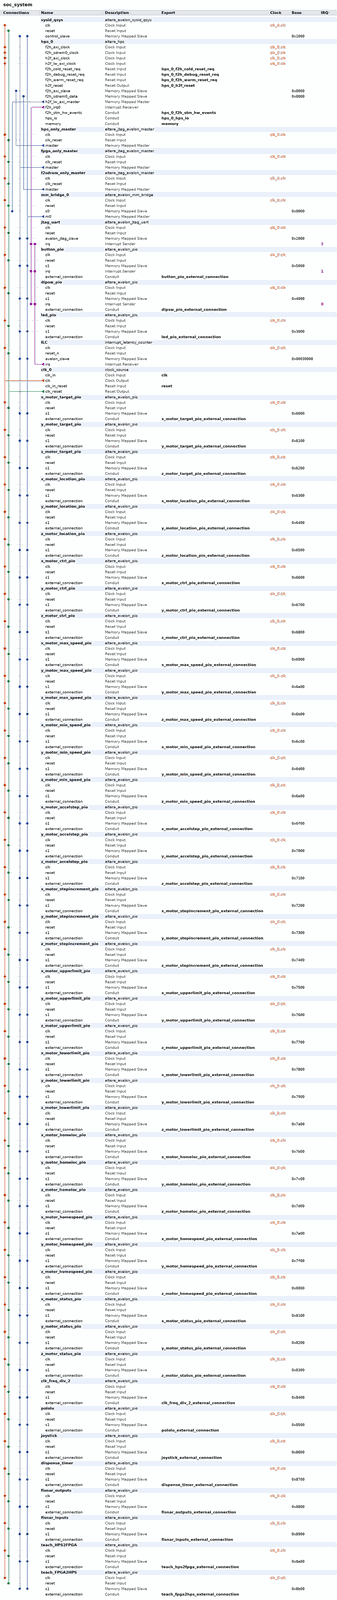
[diagram p0: system contents, whole]
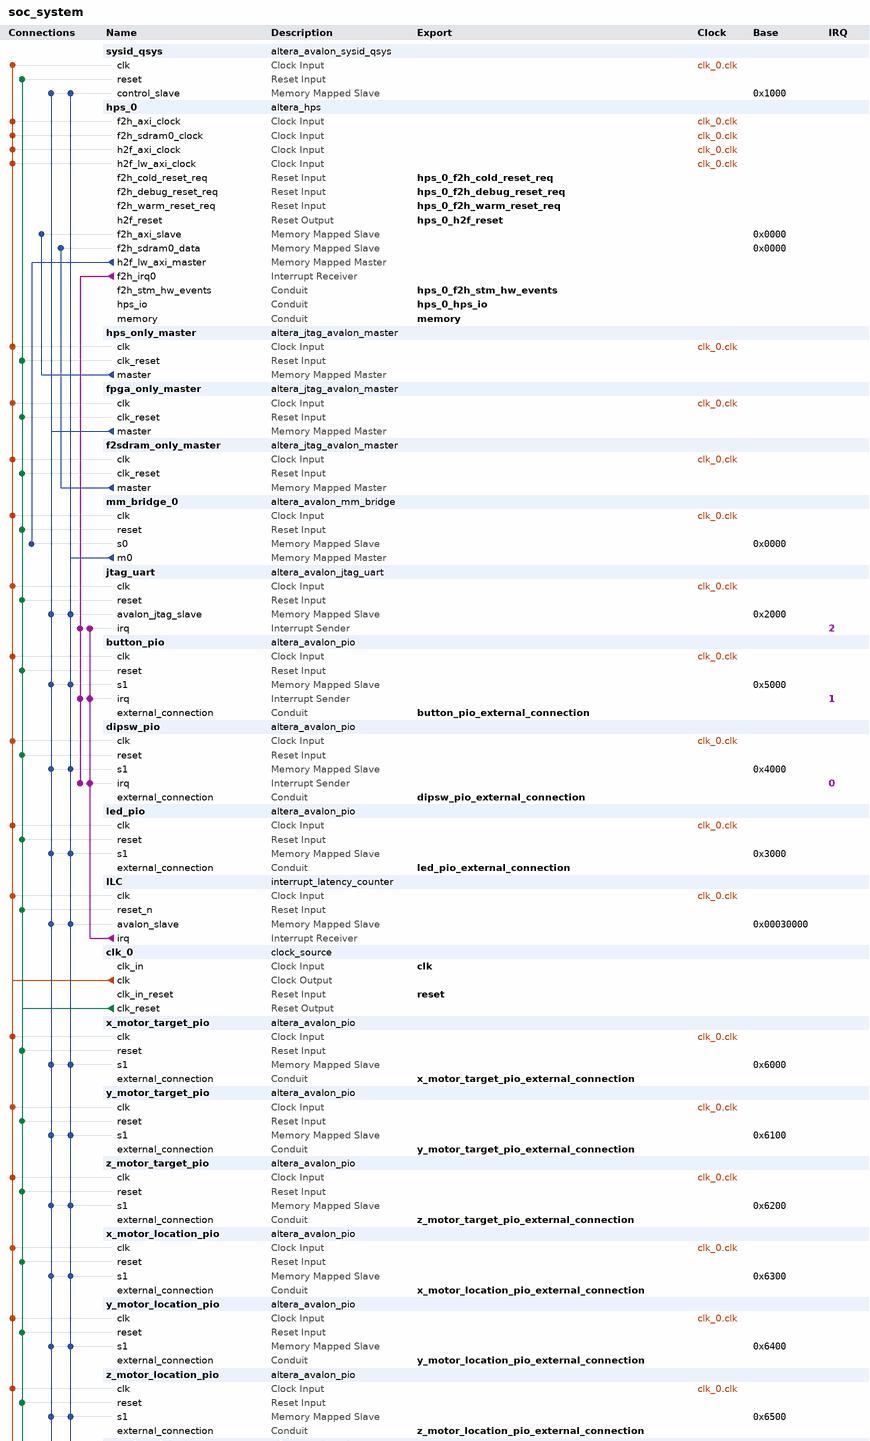
[diagram p1: system contents, upper part]
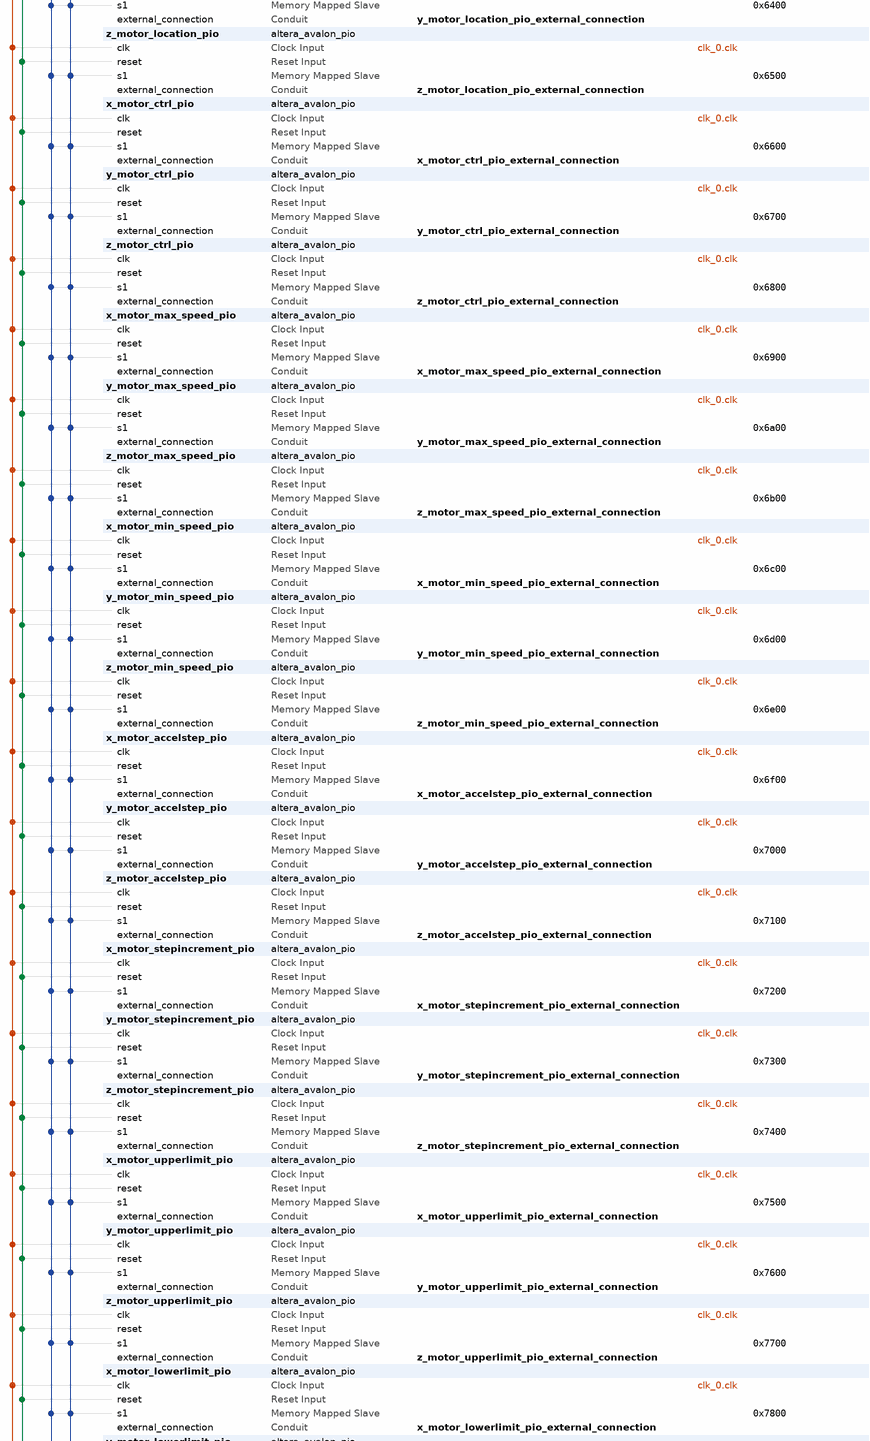
[diagram p2: system contents, middle part]
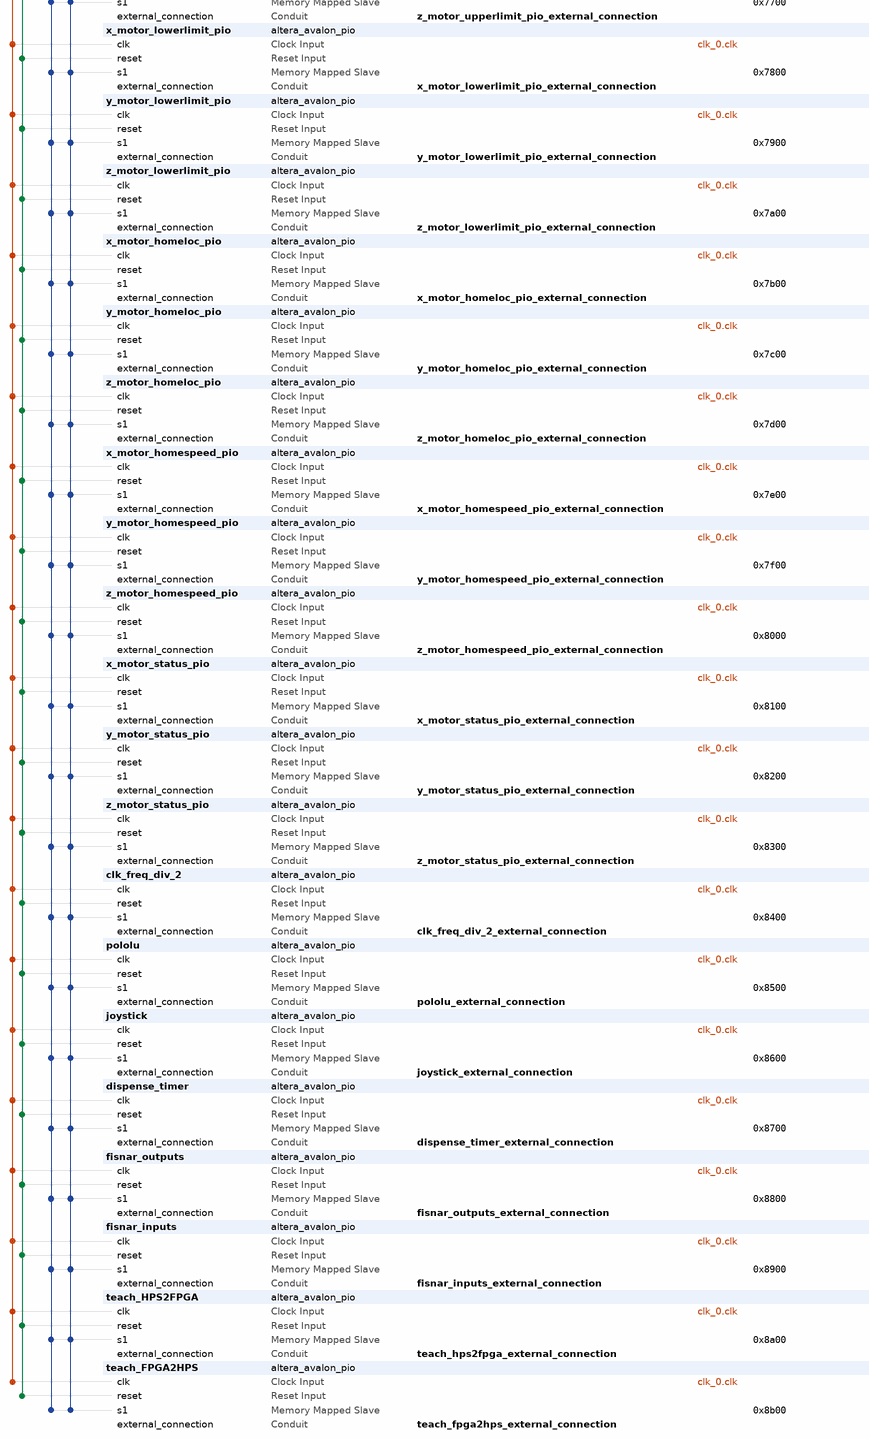
[diagram p3: system contents, lower part]
# Platform Designer (Qsys) system soc_system, Cyclone V 5CSEBA6U23I7
# Parameters at their usual value, and those the tool derives, are not listed.
package require -exact qsys 18.1
create_system soc_system
set_project_property DEVICE_FAMILY {Cyclone V}
set_project_property DEVICE 5CSEBA6U23I7

add_instance sysid_qsys altera_avalon_sysid_qsys 18.1
set_instance_parameter_value sysid_qsys id -1395322110

add_instance hps_0 altera_hps 18.1
set_instance_parameter_value hps_0 EMAC1_Mode RGMII
set_instance_parameter_value hps_0 EMAC1_PinMuxing {HPS I/O Set 0}
set_instance_parameter_value hps_0 F2SCLK_COLDRST_Enable true
set_instance_parameter_value hps_0 F2SCLK_DBGRST_Enable true
set_instance_parameter_value hps_0 F2SCLK_WARMRST_Enable true
set_instance_parameter_value hps_0 F2SDRAM_Type {Avalon-MM Bidirectional}
set_instance_parameter_value hps_0 F2SDRAM_Width 256
set_instance_parameter_value hps_0 F2SINTERRUPT_Enable true
set_instance_parameter_value hps_0 F2S_Width 2
set_instance_parameter_value hps_0 FPGA_PERIPHERAL_OUTPUT_CLOCK_FREQ_EMAC0_GTX_CLK 100
set_instance_parameter_value hps_0 FPGA_PERIPHERAL_OUTPUT_CLOCK_FREQ_EMAC0_MD_CLK 100.0
set_instance_parameter_value hps_0 FPGA_PERIPHERAL_OUTPUT_CLOCK_FREQ_EMAC1_GTX_CLK 100
set_instance_parameter_value hps_0 FPGA_PERIPHERAL_OUTPUT_CLOCK_FREQ_EMAC1_MD_CLK 100.0
set_instance_parameter_value hps_0 HPS_PROTOCOL DDR3
set_instance_parameter_value hps_0 I2C0_Mode I2C
set_instance_parameter_value hps_0 I2C0_PinMuxing {HPS I/O Set 0}
set_instance_parameter_value hps_0 I2C1_Mode I2C
set_instance_parameter_value hps_0 I2C1_PinMuxing {HPS I/O Set 0}
set_instance_parameter_value hps_0 LWH2F_Enable true
set_instance_parameter_value hps_0 MEM_BANKADDR_WIDTH 3
set_instance_parameter_value hps_0 MEM_CLK_FREQ 400.0
set_instance_parameter_value hps_0 MEM_COL_ADDR_WIDTH 10
set_instance_parameter_value hps_0 MEM_DQ_WIDTH 32
set_instance_parameter_value hps_0 MEM_DRV_STR RZQ/6
set_instance_parameter_value hps_0 MEM_ROW_ADDR_WIDTH 15
set_instance_parameter_value hps_0 MEM_RTT_NOM RZQ/6
set_instance_parameter_value hps_0 MEM_RTT_WR {Dynamic ODT off}
set_instance_parameter_value hps_0 MEM_TCL 7
set_instance_parameter_value hps_0 MEM_TFAW_NS 37.5
set_instance_parameter_value hps_0 MEM_TRAS_NS 35.0
set_instance_parameter_value hps_0 MEM_TRCD_NS 13.75
set_instance_parameter_value hps_0 MEM_TRFC_NS 300.0
set_instance_parameter_value hps_0 MEM_TRP_NS 13.75
set_instance_parameter_value hps_0 MEM_VENDOR Other
set_instance_parameter_value hps_0 MEM_WTCL 7
set_instance_parameter_value hps_0 QSPI_Mode N/A
set_instance_parameter_value hps_0 QSPI_PinMuxing Unused
set_instance_parameter_value hps_0 REF_CLK_FREQ 25.0
set_instance_parameter_value hps_0 S2FCLK_USER2CLK 4
set_instance_parameter_value hps_0 S2F_Width 2
set_instance_parameter_value hps_0 SDIO_Mode {4-bit Data}
set_instance_parameter_value hps_0 SDIO_PinMuxing {HPS I/O Set 0}
set_instance_parameter_value hps_0 SPIM1_Mode {Single Slave Select}
set_instance_parameter_value hps_0 SPIM1_PinMuxing {HPS I/O Set 0}
set_instance_parameter_value hps_0 STM_Enable true
set_instance_parameter_value hps_0 TIMING_BOARD_AC_SKEW 0.02
set_instance_parameter_value hps_0 TIMING_BOARD_AC_TO_CK_SKEW 0.0
set_instance_parameter_value hps_0 TIMING_BOARD_DQ_TO_DQS_SKEW 0.0
set_instance_parameter_value hps_0 TIMING_BOARD_MAX_CK_DELAY 0.6
set_instance_parameter_value hps_0 TIMING_BOARD_MAX_DQS_DELAY 0.6
set_instance_parameter_value hps_0 TIMING_BOARD_SKEW_BETWEEN_DQS 0.02
set_instance_parameter_value hps_0 TIMING_BOARD_SKEW_CKDQS_DIMM_MAX 0.01
set_instance_parameter_value hps_0 TIMING_BOARD_SKEW_CKDQS_DIMM_MIN -0.01
set_instance_parameter_value hps_0 TIMING_BOARD_SKEW_WITHIN_DQS 0.02
set_instance_parameter_value hps_0 TIMING_TDH 125
set_instance_parameter_value hps_0 TIMING_TDQSCK 400
set_instance_parameter_value hps_0 TIMING_TDQSQ 120
set_instance_parameter_value hps_0 TIMING_TDS 50
set_instance_parameter_value hps_0 TIMING_TIH 250
set_instance_parameter_value hps_0 TIMING_TIS 175
set_instance_parameter_value hps_0 TIMING_TQSH 0.38
set_instance_parameter_value hps_0 UART0_Mode {No Flow Control}
set_instance_parameter_value hps_0 UART0_PinMuxing {HPS I/O Set 0}
set_instance_parameter_value hps_0 USB1_Mode SDR
set_instance_parameter_value hps_0 USB1_PinMuxing {HPS I/O Set 0}
set_instance_parameter_value hps_0 desired_cfg_clk_mhz 100.0
set_instance_parameter_value hps_0 desired_qspi_clk_mhz 370.0

add_instance hps_only_master altera_jtag_avalon_master 18.1

add_instance fpga_only_master altera_jtag_avalon_master 18.1

add_instance f2sdram_only_master altera_jtag_avalon_master 18.1

add_instance mm_bridge_0 altera_avalon_mm_bridge 18.1
set_instance_parameter_value mm_bridge_0 ADDRESS_UNITS SYMBOLS
set_instance_parameter_value mm_bridge_0 ADDRESS_WIDTH 10
set_instance_parameter_value mm_bridge_0 DATA_WIDTH 32
set_instance_parameter_value mm_bridge_0 MAX_PENDING_RESPONSES 4
set_instance_parameter_value mm_bridge_0 USE_AUTO_ADDRESS_WIDTH 1

add_instance jtag_uart altera_avalon_jtag_uart 18.1
set_instance_parameter_value jtag_uart allowMultipleConnections true
set_instance_parameter_value jtag_uart simInteractiveOptions INTERACTIVE_ASCII_OUTPUT

add_instance button_pio altera_avalon_pio 18.1
set_instance_parameter_value button_pio bitClearingEdgeCapReg true
set_instance_parameter_value button_pio captureEdge true
set_instance_parameter_value button_pio direction Input
set_instance_parameter_value button_pio edgeType FALLING
set_instance_parameter_value button_pio generateIRQ true
set_instance_parameter_value button_pio irqType EDGE
set_instance_parameter_value button_pio width 2

add_instance dipsw_pio altera_avalon_pio 18.1
set_instance_parameter_value dipsw_pio bitClearingEdgeCapReg true
set_instance_parameter_value dipsw_pio captureEdge true
set_instance_parameter_value dipsw_pio direction Input
set_instance_parameter_value dipsw_pio edgeType ANY
set_instance_parameter_value dipsw_pio generateIRQ true
set_instance_parameter_value dipsw_pio irqType EDGE
set_instance_parameter_value dipsw_pio width 4

add_instance led_pio altera_avalon_pio 18.1
set_instance_parameter_value led_pio direction Output
set_instance_parameter_value led_pio resetValue 255
set_instance_parameter_value led_pio width 8

add_instance ILC interrupt_latency_counter 18.1

add_instance clk_0 clock_source 18.1
set_instance_parameter_value clk_0 clockFrequency 50000000

add_instance x_motor_target_pio altera_avalon_pio 18.1
set_instance_parameter_value x_motor_target_pio direction Output
set_instance_parameter_value x_motor_target_pio width 32

add_instance y_motor_target_pio altera_avalon_pio 18.1
set_instance_parameter_value y_motor_target_pio direction Output
set_instance_parameter_value y_motor_target_pio width 32

add_instance z_motor_target_pio altera_avalon_pio 18.1
set_instance_parameter_value z_motor_target_pio direction Output
set_instance_parameter_value z_motor_target_pio width 32

add_instance x_motor_location_pio altera_avalon_pio 18.1
set_instance_parameter_value x_motor_location_pio direction Input
set_instance_parameter_value x_motor_location_pio width 32

add_instance y_motor_location_pio altera_avalon_pio 18.1
set_instance_parameter_value y_motor_location_pio direction Input
set_instance_parameter_value y_motor_location_pio width 32

add_instance z_motor_location_pio altera_avalon_pio 18.1
set_instance_parameter_value z_motor_location_pio direction Input
set_instance_parameter_value z_motor_location_pio width 32

add_instance x_motor_ctrl_pio altera_avalon_pio 18.1
set_instance_parameter_value x_motor_ctrl_pio direction Output
set_instance_parameter_value x_motor_ctrl_pio width 32

add_instance y_motor_ctrl_pio altera_avalon_pio 18.1
set_instance_parameter_value y_motor_ctrl_pio direction Output
set_instance_parameter_value y_motor_ctrl_pio width 32

add_instance z_motor_ctrl_pio altera_avalon_pio 18.1
set_instance_parameter_value z_motor_ctrl_pio direction Output
set_instance_parameter_value z_motor_ctrl_pio width 32

add_instance x_motor_max_speed_pio altera_avalon_pio 18.1
set_instance_parameter_value x_motor_max_speed_pio direction Output
set_instance_parameter_value x_motor_max_speed_pio width 32

add_instance y_motor_max_speed_pio altera_avalon_pio 18.1
set_instance_parameter_value y_motor_max_speed_pio direction Output
set_instance_parameter_value y_motor_max_speed_pio width 32

add_instance z_motor_max_speed_pio altera_avalon_pio 18.1
set_instance_parameter_value z_motor_max_speed_pio direction Output
set_instance_parameter_value z_motor_max_speed_pio width 32

add_instance x_motor_min_speed_pio altera_avalon_pio 18.1
set_instance_parameter_value x_motor_min_speed_pio direction Output
set_instance_parameter_value x_motor_min_speed_pio width 32

add_instance y_motor_min_speed_pio altera_avalon_pio 18.1
set_instance_parameter_value y_motor_min_speed_pio direction Output
set_instance_parameter_value y_motor_min_speed_pio width 32

add_instance z_motor_min_speed_pio altera_avalon_pio 18.1
set_instance_parameter_value z_motor_min_speed_pio direction Output
set_instance_parameter_value z_motor_min_speed_pio width 32

add_instance x_motor_accelstep_pio altera_avalon_pio 18.1
set_instance_parameter_value x_motor_accelstep_pio direction Output
set_instance_parameter_value x_motor_accelstep_pio width 32

add_instance y_motor_accelstep_pio altera_avalon_pio 18.1
set_instance_parameter_value y_motor_accelstep_pio direction Output
set_instance_parameter_value y_motor_accelstep_pio width 32

add_instance z_motor_accelstep_pio altera_avalon_pio 18.1
set_instance_parameter_value z_motor_accelstep_pio direction Output
set_instance_parameter_value z_motor_accelstep_pio width 32

add_instance x_motor_stepincrement_pio altera_avalon_pio 18.1
set_instance_parameter_value x_motor_stepincrement_pio direction Output
set_instance_parameter_value x_motor_stepincrement_pio width 32

add_instance y_motor_stepincrement_pio altera_avalon_pio 18.1
set_instance_parameter_value y_motor_stepincrement_pio direction Output
set_instance_parameter_value y_motor_stepincrement_pio width 32

add_instance z_motor_stepincrement_pio altera_avalon_pio 18.1
set_instance_parameter_value z_motor_stepincrement_pio direction Output
set_instance_parameter_value z_motor_stepincrement_pio width 32

add_instance x_motor_upperlimit_pio altera_avalon_pio 18.1
set_instance_parameter_value x_motor_upperlimit_pio direction Output
set_instance_parameter_value x_motor_upperlimit_pio width 32

add_instance y_motor_upperlimit_pio altera_avalon_pio 18.1
set_instance_parameter_value y_motor_upperlimit_pio direction Output
set_instance_parameter_value y_motor_upperlimit_pio width 32

add_instance z_motor_upperlimit_pio altera_avalon_pio 18.1
set_instance_parameter_value z_motor_upperlimit_pio direction Output
set_instance_parameter_value z_motor_upperlimit_pio width 32

add_instance x_motor_lowerlimit_pio altera_avalon_pio 18.1
set_instance_parameter_value x_motor_lowerlimit_pio direction Output
set_instance_parameter_value x_motor_lowerlimit_pio width 32

add_instance y_motor_lowerlimit_pio altera_avalon_pio 18.1
set_instance_parameter_value y_motor_lowerlimit_pio direction Output
set_instance_parameter_value y_motor_lowerlimit_pio width 32

add_instance z_motor_lowerlimit_pio altera_avalon_pio 18.1
set_instance_parameter_value z_motor_lowerlimit_pio direction Output
set_instance_parameter_value z_motor_lowerlimit_pio width 32

add_instance x_motor_homeloc_pio altera_avalon_pio 18.1
set_instance_parameter_value x_motor_homeloc_pio direction Output
set_instance_parameter_value x_motor_homeloc_pio width 32

add_instance y_motor_homeloc_pio altera_avalon_pio 18.1
set_instance_parameter_value y_motor_homeloc_pio direction Output
set_instance_parameter_value y_motor_homeloc_pio width 32

add_instance z_motor_homeloc_pio altera_avalon_pio 18.1
set_instance_parameter_value z_motor_homeloc_pio direction Output
set_instance_parameter_value z_motor_homeloc_pio width 32

add_instance x_motor_homespeed_pio altera_avalon_pio 18.1
set_instance_parameter_value x_motor_homespeed_pio direction Output
set_instance_parameter_value x_motor_homespeed_pio width 32

add_instance y_motor_homespeed_pio altera_avalon_pio 18.1
set_instance_parameter_value y_motor_homespeed_pio direction Output
set_instance_parameter_value y_motor_homespeed_pio width 32

add_instance z_motor_homespeed_pio altera_avalon_pio 18.1
set_instance_parameter_value z_motor_homespeed_pio direction Output
set_instance_parameter_value z_motor_homespeed_pio width 32

add_instance x_motor_status_pio altera_avalon_pio 18.1
set_instance_parameter_value x_motor_status_pio direction Input
set_instance_parameter_value x_motor_status_pio width 32

add_instance y_motor_status_pio altera_avalon_pio 18.1
set_instance_parameter_value y_motor_status_pio direction Input
set_instance_parameter_value y_motor_status_pio width 32

add_instance z_motor_status_pio altera_avalon_pio 18.1
set_instance_parameter_value z_motor_status_pio direction Input
set_instance_parameter_value z_motor_status_pio width 32

add_instance clk_freq_div_2 altera_avalon_pio 18.1
set_instance_parameter_value clk_freq_div_2 direction Output
set_instance_parameter_value clk_freq_div_2 width 32

add_instance pololu altera_avalon_pio 18.1
set_instance_parameter_value pololu direction Output
set_instance_parameter_value pololu width 32

add_instance joystick altera_avalon_pio 18.1
set_instance_parameter_value joystick direction Input
set_instance_parameter_value joystick width 32

add_instance dispense_timer altera_avalon_pio 18.1
set_instance_parameter_value dispense_timer direction Output
set_instance_parameter_value dispense_timer width 32

add_instance fisnar_outputs altera_avalon_pio 18.1
set_instance_parameter_value fisnar_outputs direction Output
set_instance_parameter_value fisnar_outputs width 32

add_instance fisnar_inputs altera_avalon_pio 18.1
set_instance_parameter_value fisnar_inputs direction Input
set_instance_parameter_value fisnar_inputs width 32

add_instance teach_HPS2FPGA altera_avalon_pio 18.1
set_instance_parameter_value teach_HPS2FPGA direction Output
set_instance_parameter_value teach_HPS2FPGA width 32

add_instance teach_FPGA2HPS altera_avalon_pio 18.1
set_instance_parameter_value teach_FPGA2HPS direction Input
set_instance_parameter_value teach_FPGA2HPS width 32

# connections
add_connection clk_0.clk button_pio.clk clock
add_connection clk_0.clk clk_freq_div_2.clk clock
add_connection clk_0.clk dipsw_pio.clk clock
add_connection clk_0.clk dispense_timer.clk clock
add_connection clk_0.clk f2sdram_only_master.clk clock
add_connection clk_0.clk fisnar_inputs.clk clock
add_connection clk_0.clk fisnar_outputs.clk clock
add_connection clk_0.clk fpga_only_master.clk clock
add_connection clk_0.clk hps_0.f2h_axi_clock clock
add_connection clk_0.clk hps_0.f2h_sdram0_clock clock
add_connection clk_0.clk hps_0.h2f_axi_clock clock
add_connection clk_0.clk hps_0.h2f_lw_axi_clock clock
add_connection clk_0.clk hps_only_master.clk clock
add_connection clk_0.clk ILC.clk clock
add_connection clk_0.clk joystick.clk clock
add_connection clk_0.clk jtag_uart.clk clock
add_connection clk_0.clk led_pio.clk clock
add_connection clk_0.clk mm_bridge_0.clk clock
add_connection clk_0.clk pololu.clk clock
add_connection clk_0.clk sysid_qsys.clk clock
add_connection clk_0.clk teach_FPGA2HPS.clk clock
add_connection clk_0.clk teach_HPS2FPGA.clk clock
add_connection clk_0.clk x_motor_accelstep_pio.clk clock
add_connection clk_0.clk x_motor_ctrl_pio.clk clock
add_connection clk_0.clk x_motor_homeloc_pio.clk clock
add_connection clk_0.clk x_motor_homespeed_pio.clk clock
add_connection clk_0.clk x_motor_location_pio.clk clock
add_connection clk_0.clk x_motor_lowerlimit_pio.clk clock
add_connection clk_0.clk x_motor_max_speed_pio.clk clock
add_connection clk_0.clk x_motor_min_speed_pio.clk clock
add_connection clk_0.clk x_motor_status_pio.clk clock
add_connection clk_0.clk x_motor_stepincrement_pio.clk clock
add_connection clk_0.clk x_motor_target_pio.clk clock
add_connection clk_0.clk x_motor_upperlimit_pio.clk clock
add_connection clk_0.clk y_motor_accelstep_pio.clk clock
add_connection clk_0.clk y_motor_ctrl_pio.clk clock
add_connection clk_0.clk y_motor_homeloc_pio.clk clock
add_connection clk_0.clk y_motor_homespeed_pio.clk clock
add_connection clk_0.clk y_motor_location_pio.clk clock
add_connection clk_0.clk y_motor_lowerlimit_pio.clk clock
add_connection clk_0.clk y_motor_max_speed_pio.clk clock
add_connection clk_0.clk y_motor_min_speed_pio.clk clock
add_connection clk_0.clk y_motor_status_pio.clk clock
add_connection clk_0.clk y_motor_stepincrement_pio.clk clock
add_connection clk_0.clk y_motor_target_pio.clk clock
add_connection clk_0.clk y_motor_upperlimit_pio.clk clock
add_connection clk_0.clk z_motor_accelstep_pio.clk clock
add_connection clk_0.clk z_motor_ctrl_pio.clk clock
add_connection clk_0.clk z_motor_homeloc_pio.clk clock
add_connection clk_0.clk z_motor_homespeed_pio.clk clock
add_connection clk_0.clk z_motor_location_pio.clk clock
add_connection clk_0.clk z_motor_lowerlimit_pio.clk clock
add_connection clk_0.clk z_motor_max_speed_pio.clk clock
add_connection clk_0.clk z_motor_min_speed_pio.clk clock
add_connection clk_0.clk z_motor_status_pio.clk clock
add_connection clk_0.clk z_motor_stepincrement_pio.clk clock
add_connection clk_0.clk z_motor_target_pio.clk clock
add_connection clk_0.clk z_motor_upperlimit_pio.clk clock
add_connection clk_0.clk_reset button_pio.reset reset
add_connection clk_0.clk_reset clk_freq_div_2.reset reset
add_connection clk_0.clk_reset dipsw_pio.reset reset
add_connection clk_0.clk_reset dispense_timer.reset reset
add_connection clk_0.clk_reset f2sdram_only_master.clk_reset reset
add_connection clk_0.clk_reset fisnar_inputs.reset reset
add_connection clk_0.clk_reset fisnar_outputs.reset reset
add_connection clk_0.clk_reset fpga_only_master.clk_reset reset
add_connection clk_0.clk_reset hps_only_master.clk_reset reset
add_connection clk_0.clk_reset ILC.reset_n reset
add_connection clk_0.clk_reset joystick.reset reset
add_connection clk_0.clk_reset jtag_uart.reset reset
add_connection clk_0.clk_reset led_pio.reset reset
add_connection clk_0.clk_reset mm_bridge_0.reset reset
add_connection clk_0.clk_reset pololu.reset reset
add_connection clk_0.clk_reset sysid_qsys.reset reset
add_connection clk_0.clk_reset teach_FPGA2HPS.reset reset
add_connection clk_0.clk_reset teach_HPS2FPGA.reset reset
add_connection clk_0.clk_reset x_motor_accelstep_pio.reset reset
add_connection clk_0.clk_reset x_motor_ctrl_pio.reset reset
add_connection clk_0.clk_reset x_motor_homeloc_pio.reset reset
add_connection clk_0.clk_reset x_motor_homespeed_pio.reset reset
add_connection clk_0.clk_reset x_motor_location_pio.reset reset
add_connection clk_0.clk_reset x_motor_lowerlimit_pio.reset reset
add_connection clk_0.clk_reset x_motor_max_speed_pio.reset reset
add_connection clk_0.clk_reset x_motor_min_speed_pio.reset reset
add_connection clk_0.clk_reset x_motor_status_pio.reset reset
add_connection clk_0.clk_reset x_motor_stepincrement_pio.reset reset
add_connection clk_0.clk_reset x_motor_target_pio.reset reset
add_connection clk_0.clk_reset x_motor_upperlimit_pio.reset reset
add_connection clk_0.clk_reset y_motor_accelstep_pio.reset reset
add_connection clk_0.clk_reset y_motor_ctrl_pio.reset reset
add_connection clk_0.clk_reset y_motor_homeloc_pio.reset reset
add_connection clk_0.clk_reset y_motor_homespeed_pio.reset reset
add_connection clk_0.clk_reset y_motor_location_pio.reset reset
add_connection clk_0.clk_reset y_motor_lowerlimit_pio.reset reset
add_connection clk_0.clk_reset y_motor_max_speed_pio.reset reset
add_connection clk_0.clk_reset y_motor_min_speed_pio.reset reset
add_connection clk_0.clk_reset y_motor_status_pio.reset reset
add_connection clk_0.clk_reset y_motor_stepincrement_pio.reset reset
add_connection clk_0.clk_reset y_motor_target_pio.reset reset
add_connection clk_0.clk_reset y_motor_upperlimit_pio.reset reset
add_connection clk_0.clk_reset z_motor_accelstep_pio.reset reset
add_connection clk_0.clk_reset z_motor_ctrl_pio.reset reset
add_connection clk_0.clk_reset z_motor_homeloc_pio.reset reset
add_connection clk_0.clk_reset z_motor_homespeed_pio.reset reset
add_connection clk_0.clk_reset z_motor_location_pio.reset reset
add_connection clk_0.clk_reset z_motor_lowerlimit_pio.reset reset
add_connection clk_0.clk_reset z_motor_max_speed_pio.reset reset
add_connection clk_0.clk_reset z_motor_min_speed_pio.reset reset
add_connection clk_0.clk_reset z_motor_status_pio.reset reset
add_connection clk_0.clk_reset z_motor_stepincrement_pio.reset reset
add_connection clk_0.clk_reset z_motor_target_pio.reset reset
add_connection clk_0.clk_reset z_motor_upperlimit_pio.reset reset
add_connection f2sdram_only_master.master hps_0.f2h_sdram0_data avalon
set_connection_parameter_value f2sdram_only_master.master/hps_0.f2h_sdram0_data baseAddress 0x0000
add_connection fpga_only_master.master button_pio.s1 avalon
set_connection_parameter_value fpga_only_master.master/button_pio.s1 baseAddress 0x5000
add_connection fpga_only_master.master clk_freq_div_2.s1 avalon
set_connection_parameter_value fpga_only_master.master/clk_freq_div_2.s1 baseAddress 0x8400
add_connection fpga_only_master.master dipsw_pio.s1 avalon
set_connection_parameter_value fpga_only_master.master/dipsw_pio.s1 baseAddress 0x4000
add_connection fpga_only_master.master dispense_timer.s1 avalon
set_connection_parameter_value fpga_only_master.master/dispense_timer.s1 baseAddress 0x8700
add_connection fpga_only_master.master fisnar_inputs.s1 avalon
set_connection_parameter_value fpga_only_master.master/fisnar_inputs.s1 baseAddress 0x8900
add_connection fpga_only_master.master fisnar_outputs.s1 avalon
set_connection_parameter_value fpga_only_master.master/fisnar_outputs.s1 baseAddress 0x8800
add_connection fpga_only_master.master ILC.avalon_slave avalon
set_connection_parameter_value fpga_only_master.master/ILC.avalon_slave baseAddress 0x00030000
add_connection fpga_only_master.master joystick.s1 avalon
set_connection_parameter_value fpga_only_master.master/joystick.s1 baseAddress 0x8600
add_connection fpga_only_master.master jtag_uart.avalon_jtag_slave avalon
set_connection_parameter_value fpga_only_master.master/jtag_uart.avalon_jtag_slave baseAddress 0x2000
add_connection fpga_only_master.master led_pio.s1 avalon
set_connection_parameter_value fpga_only_master.master/led_pio.s1 baseAddress 0x3000
add_connection fpga_only_master.master pololu.s1 avalon
set_connection_parameter_value fpga_only_master.master/pololu.s1 baseAddress 0x8500
add_connection fpga_only_master.master sysid_qsys.control_slave avalon
set_connection_parameter_value fpga_only_master.master/sysid_qsys.control_slave baseAddress 0x1000
add_connection fpga_only_master.master teach_FPGA2HPS.s1 avalon
set_connection_parameter_value fpga_only_master.master/teach_FPGA2HPS.s1 baseAddress 0x8b00
add_connection fpga_only_master.master teach_HPS2FPGA.s1 avalon
set_connection_parameter_value fpga_only_master.master/teach_HPS2FPGA.s1 baseAddress 0x8a00
add_connection fpga_only_master.master x_motor_accelstep_pio.s1 avalon
set_connection_parameter_value fpga_only_master.master/x_motor_accelstep_pio.s1 baseAddress 0x6f00
add_connection fpga_only_master.master x_motor_ctrl_pio.s1 avalon
set_connection_parameter_value fpga_only_master.master/x_motor_ctrl_pio.s1 baseAddress 0x6600
add_connection fpga_only_master.master x_motor_homeloc_pio.s1 avalon
set_connection_parameter_value fpga_only_master.master/x_motor_homeloc_pio.s1 baseAddress 0x7b00
add_connection fpga_only_master.master x_motor_homespeed_pio.s1 avalon
set_connection_parameter_value fpga_only_master.master/x_motor_homespeed_pio.s1 baseAddress 0x7e00
add_connection fpga_only_master.master x_motor_location_pio.s1 avalon
set_connection_parameter_value fpga_only_master.master/x_motor_location_pio.s1 baseAddress 0x6300
add_connection fpga_only_master.master x_motor_lowerlimit_pio.s1 avalon
set_connection_parameter_value fpga_only_master.master/x_motor_lowerlimit_pio.s1 baseAddress 0x7800
add_connection fpga_only_master.master x_motor_max_speed_pio.s1 avalon
set_connection_parameter_value fpga_only_master.master/x_motor_max_speed_pio.s1 baseAddress 0x6900
add_connection fpga_only_master.master x_motor_min_speed_pio.s1 avalon
set_connection_parameter_value fpga_only_master.master/x_motor_min_speed_pio.s1 baseAddress 0x6c00
add_connection fpga_only_master.master x_motor_status_pio.s1 avalon
set_connection_parameter_value fpga_only_master.master/x_motor_status_pio.s1 baseAddress 0x8100
add_connection fpga_only_master.master x_motor_stepincrement_pio.s1 avalon
set_connection_parameter_value fpga_only_master.master/x_motor_stepincrement_pio.s1 baseAddress 0x7200
add_connection fpga_only_master.master x_motor_target_pio.s1 avalon
set_connection_parameter_value fpga_only_master.master/x_motor_target_pio.s1 baseAddress 0x6000
add_connection fpga_only_master.master x_motor_upperlimit_pio.s1 avalon
set_connection_parameter_value fpga_only_master.master/x_motor_upperlimit_pio.s1 baseAddress 0x7500
add_connection fpga_only_master.master y_motor_accelstep_pio.s1 avalon
set_connection_parameter_value fpga_only_master.master/y_motor_accelstep_pio.s1 baseAddress 0x7000
add_connection fpga_only_master.master y_motor_ctrl_pio.s1 avalon
set_connection_parameter_value fpga_only_master.master/y_motor_ctrl_pio.s1 baseAddress 0x6700
add_connection fpga_only_master.master y_motor_homeloc_pio.s1 avalon
set_connection_parameter_value fpga_only_master.master/y_motor_homeloc_pio.s1 baseAddress 0x7c00
add_connection fpga_only_master.master y_motor_homespeed_pio.s1 avalon
set_connection_parameter_value fpga_only_master.master/y_motor_homespeed_pio.s1 baseAddress 0x7f00
add_connection fpga_only_master.master y_motor_location_pio.s1 avalon
set_connection_parameter_value fpga_only_master.master/y_motor_location_pio.s1 baseAddress 0x6400
add_connection fpga_only_master.master y_motor_lowerlimit_pio.s1 avalon
set_connection_parameter_value fpga_only_master.master/y_motor_lowerlimit_pio.s1 baseAddress 0x7900
add_connection fpga_only_master.master y_motor_max_speed_pio.s1 avalon
set_connection_parameter_value fpga_only_master.master/y_motor_max_speed_pio.s1 baseAddress 0x6a00
add_connection fpga_only_master.master y_motor_min_speed_pio.s1 avalon
set_connection_parameter_value fpga_only_master.master/y_motor_min_speed_pio.s1 baseAddress 0x6d00
add_connection fpga_only_master.master y_motor_status_pio.s1 avalon
set_connection_parameter_value fpga_only_master.master/y_motor_status_pio.s1 baseAddress 0x8200
add_connection fpga_only_master.master y_motor_stepincrement_pio.s1 avalon
set_connection_parameter_value fpga_only_master.master/y_motor_stepincrement_pio.s1 baseAddress 0x7300
add_connection fpga_only_master.master y_motor_target_pio.s1 avalon
set_connection_parameter_value fpga_only_master.master/y_motor_target_pio.s1 baseAddress 0x6100
add_connection fpga_only_master.master y_motor_upperlimit_pio.s1 avalon
set_connection_parameter_value fpga_only_master.master/y_motor_upperlimit_pio.s1 baseAddress 0x7600
add_connection fpga_only_master.master z_motor_accelstep_pio.s1 avalon
set_connection_parameter_value fpga_only_master.master/z_motor_accelstep_pio.s1 baseAddress 0x7100
add_connection fpga_only_master.master z_motor_ctrl_pio.s1 avalon
set_connection_parameter_value fpga_only_master.master/z_motor_ctrl_pio.s1 baseAddress 0x6800
add_connection fpga_only_master.master z_motor_homeloc_pio.s1 avalon
set_connection_parameter_value fpga_only_master.master/z_motor_homeloc_pio.s1 baseAddress 0x7d00
add_connection fpga_only_master.master z_motor_homespeed_pio.s1 avalon
set_connection_parameter_value fpga_only_master.master/z_motor_homespeed_pio.s1 baseAddress 0x8000
add_connection fpga_only_master.master z_motor_location_pio.s1 avalon
set_connection_parameter_value fpga_only_master.master/z_motor_location_pio.s1 baseAddress 0x6500
add_connection fpga_only_master.master z_motor_lowerlimit_pio.s1 avalon
set_connection_parameter_value fpga_only_master.master/z_motor_lowerlimit_pio.s1 baseAddress 0x7a00
add_connection fpga_only_master.master z_motor_max_speed_pio.s1 avalon
set_connection_parameter_value fpga_only_master.master/z_motor_max_speed_pio.s1 baseAddress 0x6b00
add_connection fpga_only_master.master z_motor_min_speed_pio.s1 avalon
set_connection_parameter_value fpga_only_master.master/z_motor_min_speed_pio.s1 baseAddress 0x6e00
add_connection fpga_only_master.master z_motor_status_pio.s1 avalon
set_connection_parameter_value fpga_only_master.master/z_motor_status_pio.s1 baseAddress 0x8300
add_connection fpga_only_master.master z_motor_stepincrement_pio.s1 avalon
set_connection_parameter_value fpga_only_master.master/z_motor_stepincrement_pio.s1 baseAddress 0x7400
add_connection fpga_only_master.master z_motor_target_pio.s1 avalon
set_connection_parameter_value fpga_only_master.master/z_motor_target_pio.s1 baseAddress 0x6200
add_connection fpga_only_master.master z_motor_upperlimit_pio.s1 avalon
set_connection_parameter_value fpga_only_master.master/z_motor_upperlimit_pio.s1 baseAddress 0x7700
add_connection hps_0.h2f_lw_axi_master mm_bridge_0.s0 avalon
set_connection_parameter_value hps_0.h2f_lw_axi_master/mm_bridge_0.s0 baseAddress 0x0000
add_connection hps_only_master.master hps_0.f2h_axi_slave avalon
set_connection_parameter_value hps_only_master.master/hps_0.f2h_axi_slave baseAddress 0x0000
add_connection mm_bridge_0.m0 button_pio.s1 avalon
set_connection_parameter_value mm_bridge_0.m0/button_pio.s1 baseAddress 0x5000
add_connection mm_bridge_0.m0 clk_freq_div_2.s1 avalon
set_connection_parameter_value mm_bridge_0.m0/clk_freq_div_2.s1 baseAddress 0x8400
add_connection mm_bridge_0.m0 dipsw_pio.s1 avalon
set_connection_parameter_value mm_bridge_0.m0/dipsw_pio.s1 baseAddress 0x4000
add_connection mm_bridge_0.m0 dispense_timer.s1 avalon
set_connection_parameter_value mm_bridge_0.m0/dispense_timer.s1 baseAddress 0x8700
add_connection mm_bridge_0.m0 fisnar_inputs.s1 avalon
set_connection_parameter_value mm_bridge_0.m0/fisnar_inputs.s1 baseAddress 0x8900
add_connection mm_bridge_0.m0 fisnar_outputs.s1 avalon
set_connection_parameter_value mm_bridge_0.m0/fisnar_outputs.s1 baseAddress 0x8800
add_connection mm_bridge_0.m0 ILC.avalon_slave avalon
set_connection_parameter_value mm_bridge_0.m0/ILC.avalon_slave baseAddress 0x00030000
add_connection mm_bridge_0.m0 joystick.s1 avalon
set_connection_parameter_value mm_bridge_0.m0/joystick.s1 baseAddress 0x8600
add_connection mm_bridge_0.m0 jtag_uart.avalon_jtag_slave avalon
set_connection_parameter_value mm_bridge_0.m0/jtag_uart.avalon_jtag_slave baseAddress 0x2000
add_connection mm_bridge_0.m0 led_pio.s1 avalon
set_connection_parameter_value mm_bridge_0.m0/led_pio.s1 baseAddress 0x3000
add_connection mm_bridge_0.m0 pololu.s1 avalon
set_connection_parameter_value mm_bridge_0.m0/pololu.s1 baseAddress 0x8500
add_connection mm_bridge_0.m0 sysid_qsys.control_slave avalon
set_connection_parameter_value mm_bridge_0.m0/sysid_qsys.control_slave baseAddress 0x1000
add_connection mm_bridge_0.m0 teach_FPGA2HPS.s1 avalon
set_connection_parameter_value mm_bridge_0.m0/teach_FPGA2HPS.s1 baseAddress 0x8b00
add_connection mm_bridge_0.m0 teach_HPS2FPGA.s1 avalon
set_connection_parameter_value mm_bridge_0.m0/teach_HPS2FPGA.s1 baseAddress 0x8a00
add_connection mm_bridge_0.m0 x_motor_accelstep_pio.s1 avalon
set_connection_parameter_value mm_bridge_0.m0/x_motor_accelstep_pio.s1 baseAddress 0x6f00
add_connection mm_bridge_0.m0 x_motor_ctrl_pio.s1 avalon
set_connection_parameter_value mm_bridge_0.m0/x_motor_ctrl_pio.s1 baseAddress 0x6600
add_connection mm_bridge_0.m0 x_motor_homeloc_pio.s1 avalon
set_connection_parameter_value mm_bridge_0.m0/x_motor_homeloc_pio.s1 baseAddress 0x7b00
add_connection mm_bridge_0.m0 x_motor_homespeed_pio.s1 avalon
set_connection_parameter_value mm_bridge_0.m0/x_motor_homespeed_pio.s1 baseAddress 0x7e00
add_connection mm_bridge_0.m0 x_motor_location_pio.s1 avalon
set_connection_parameter_value mm_bridge_0.m0/x_motor_location_pio.s1 baseAddress 0x6300
add_connection mm_bridge_0.m0 x_motor_lowerlimit_pio.s1 avalon
set_connection_parameter_value mm_bridge_0.m0/x_motor_lowerlimit_pio.s1 baseAddress 0x7800
add_connection mm_bridge_0.m0 x_motor_max_speed_pio.s1 avalon
set_connection_parameter_value mm_bridge_0.m0/x_motor_max_speed_pio.s1 baseAddress 0x6900
add_connection mm_bridge_0.m0 x_motor_min_speed_pio.s1 avalon
set_connection_parameter_value mm_bridge_0.m0/x_motor_min_speed_pio.s1 baseAddress 0x6c00
add_connection mm_bridge_0.m0 x_motor_status_pio.s1 avalon
set_connection_parameter_value mm_bridge_0.m0/x_motor_status_pio.s1 baseAddress 0x8100
add_connection mm_bridge_0.m0 x_motor_stepincrement_pio.s1 avalon
set_connection_parameter_value mm_bridge_0.m0/x_motor_stepincrement_pio.s1 baseAddress 0x7200
add_connection mm_bridge_0.m0 x_motor_target_pio.s1 avalon
set_connection_parameter_value mm_bridge_0.m0/x_motor_target_pio.s1 baseAddress 0x6000
add_connection mm_bridge_0.m0 x_motor_upperlimit_pio.s1 avalon
set_connection_parameter_value mm_bridge_0.m0/x_motor_upperlimit_pio.s1 baseAddress 0x7500
add_connection mm_bridge_0.m0 y_motor_accelstep_pio.s1 avalon
set_connection_parameter_value mm_bridge_0.m0/y_motor_accelstep_pio.s1 baseAddress 0x7000
add_connection mm_bridge_0.m0 y_motor_ctrl_pio.s1 avalon
set_connection_parameter_value mm_bridge_0.m0/y_motor_ctrl_pio.s1 baseAddress 0x6700
add_connection mm_bridge_0.m0 y_motor_homeloc_pio.s1 avalon
set_connection_parameter_value mm_bridge_0.m0/y_motor_homeloc_pio.s1 baseAddress 0x7c00
add_connection mm_bridge_0.m0 y_motor_homespeed_pio.s1 avalon
set_connection_parameter_value mm_bridge_0.m0/y_motor_homespeed_pio.s1 baseAddress 0x7f00
add_connection mm_bridge_0.m0 y_motor_location_pio.s1 avalon
set_connection_parameter_value mm_bridge_0.m0/y_motor_location_pio.s1 baseAddress 0x6400
add_connection mm_bridge_0.m0 y_motor_lowerlimit_pio.s1 avalon
set_connection_parameter_value mm_bridge_0.m0/y_motor_lowerlimit_pio.s1 baseAddress 0x7900
add_connection mm_bridge_0.m0 y_motor_max_speed_pio.s1 avalon
set_connection_parameter_value mm_bridge_0.m0/y_motor_max_speed_pio.s1 baseAddress 0x6a00
add_connection mm_bridge_0.m0 y_motor_min_speed_pio.s1 avalon
set_connection_parameter_value mm_bridge_0.m0/y_motor_min_speed_pio.s1 baseAddress 0x6d00
add_connection mm_bridge_0.m0 y_motor_status_pio.s1 avalon
set_connection_parameter_value mm_bridge_0.m0/y_motor_status_pio.s1 baseAddress 0x8200
add_connection mm_bridge_0.m0 y_motor_stepincrement_pio.s1 avalon
set_connection_parameter_value mm_bridge_0.m0/y_motor_stepincrement_pio.s1 baseAddress 0x7300
add_connection mm_bridge_0.m0 y_motor_target_pio.s1 avalon
set_connection_parameter_value mm_bridge_0.m0/y_motor_target_pio.s1 baseAddress 0x6100
add_connection mm_bridge_0.m0 y_motor_upperlimit_pio.s1 avalon
set_connection_parameter_value mm_bridge_0.m0/y_motor_upperlimit_pio.s1 baseAddress 0x7600
add_connection mm_bridge_0.m0 z_motor_accelstep_pio.s1 avalon
set_connection_parameter_value mm_bridge_0.m0/z_motor_accelstep_pio.s1 baseAddress 0x7100
add_connection mm_bridge_0.m0 z_motor_ctrl_pio.s1 avalon
set_connection_parameter_value mm_bridge_0.m0/z_motor_ctrl_pio.s1 baseAddress 0x6800
add_connection mm_bridge_0.m0 z_motor_homeloc_pio.s1 avalon
set_connection_parameter_value mm_bridge_0.m0/z_motor_homeloc_pio.s1 baseAddress 0x7d00
add_connection mm_bridge_0.m0 z_motor_homespeed_pio.s1 avalon
set_connection_parameter_value mm_bridge_0.m0/z_motor_homespeed_pio.s1 baseAddress 0x8000
add_connection mm_bridge_0.m0 z_motor_location_pio.s1 avalon
set_connection_parameter_value mm_bridge_0.m0/z_motor_location_pio.s1 baseAddress 0x6500
add_connection mm_bridge_0.m0 z_motor_lowerlimit_pio.s1 avalon
set_connection_parameter_value mm_bridge_0.m0/z_motor_lowerlimit_pio.s1 baseAddress 0x7a00
add_connection mm_bridge_0.m0 z_motor_max_speed_pio.s1 avalon
set_connection_parameter_value mm_bridge_0.m0/z_motor_max_speed_pio.s1 baseAddress 0x6b00
add_connection mm_bridge_0.m0 z_motor_min_speed_pio.s1 avalon
set_connection_parameter_value mm_bridge_0.m0/z_motor_min_speed_pio.s1 baseAddress 0x6e00
add_connection mm_bridge_0.m0 z_motor_status_pio.s1 avalon
set_connection_parameter_value mm_bridge_0.m0/z_motor_status_pio.s1 baseAddress 0x8300
add_connection mm_bridge_0.m0 z_motor_stepincrement_pio.s1 avalon
set_connection_parameter_value mm_bridge_0.m0/z_motor_stepincrement_pio.s1 baseAddress 0x7400
add_connection mm_bridge_0.m0 z_motor_target_pio.s1 avalon
set_connection_parameter_value mm_bridge_0.m0/z_motor_target_pio.s1 baseAddress 0x6200
add_connection mm_bridge_0.m0 z_motor_upperlimit_pio.s1 avalon
set_connection_parameter_value mm_bridge_0.m0/z_motor_upperlimit_pio.s1 baseAddress 0x7700
add_connection hps_0.f2h_irq0 button_pio.irq interrupt
set_connection_parameter_value hps_0.f2h_irq0/button_pio.irq irqNumber 1
add_connection hps_0.f2h_irq0 dipsw_pio.irq interrupt
set_connection_parameter_value hps_0.f2h_irq0/dipsw_pio.irq irqNumber 0
add_connection hps_0.f2h_irq0 jtag_uart.irq interrupt
set_connection_parameter_value hps_0.f2h_irq0/jtag_uart.irq irqNumber 2
add_connection ILC.irq button_pio.irq interrupt
set_connection_parameter_value ILC.irq/button_pio.irq irqNumber 1
add_connection ILC.irq dipsw_pio.irq interrupt
set_connection_parameter_value ILC.irq/dipsw_pio.irq irqNumber 0
add_connection ILC.irq jtag_uart.irq interrupt
set_connection_parameter_value ILC.irq/jtag_uart.irq irqNumber 2

# exported interfaces
add_interface button_pio_external_connection conduit end
set_interface_property button_pio_external_connection EXPORT_OF button_pio.external_connection
add_interface clk clock sink
set_interface_property clk EXPORT_OF clk_0.clk_in
add_interface clk_freq_div_2_external_connection conduit end
set_interface_property clk_freq_div_2_external_connection EXPORT_OF clk_freq_div_2.external_connection
add_interface dipsw_pio_external_connection conduit end
set_interface_property dipsw_pio_external_connection EXPORT_OF dipsw_pio.external_connection
add_interface dispense_timer_external_connection conduit end
set_interface_property dispense_timer_external_connection EXPORT_OF dispense_timer.external_connection
add_interface fisnar_inputs_external_connection conduit end
set_interface_property fisnar_inputs_external_connection EXPORT_OF fisnar_inputs.external_connection
add_interface fisnar_outputs_external_connection conduit end
set_interface_property fisnar_outputs_external_connection EXPORT_OF fisnar_outputs.external_connection
add_interface hps_0_f2h_cold_reset_req reset sink
set_interface_property hps_0_f2h_cold_reset_req EXPORT_OF hps_0.f2h_cold_reset_req
add_interface hps_0_f2h_debug_reset_req reset sink
set_interface_property hps_0_f2h_debug_reset_req EXPORT_OF hps_0.f2h_debug_reset_req
add_interface hps_0_f2h_stm_hw_events conduit end
set_interface_property hps_0_f2h_stm_hw_events EXPORT_OF hps_0.f2h_stm_hw_events
add_interface hps_0_f2h_warm_reset_req reset sink
set_interface_property hps_0_f2h_warm_reset_req EXPORT_OF hps_0.f2h_warm_reset_req
add_interface hps_0_h2f_reset reset source
set_interface_property hps_0_h2f_reset EXPORT_OF hps_0.h2f_reset
add_interface hps_0_hps_io conduit end
set_interface_property hps_0_hps_io EXPORT_OF hps_0.hps_io
add_interface joystick_external_connection conduit end
set_interface_property joystick_external_connection EXPORT_OF joystick.external_connection
add_interface led_pio_external_connection conduit end
set_interface_property led_pio_external_connection EXPORT_OF led_pio.external_connection
add_interface memory conduit end
set_interface_property memory EXPORT_OF hps_0.memory
add_interface pololu_external_connection conduit end
set_interface_property pololu_external_connection EXPORT_OF pololu.external_connection
add_interface reset reset sink
set_interface_property reset EXPORT_OF clk_0.clk_in_reset
add_interface teach_fpga2hps_external_connection conduit end
set_interface_property teach_fpga2hps_external_connection EXPORT_OF teach_FPGA2HPS.external_connection
add_interface teach_hps2fpga_external_connection conduit end
set_interface_property teach_hps2fpga_external_connection EXPORT_OF teach_HPS2FPGA.external_connection
add_interface x_motor_accelstep_pio_external_connection conduit end
set_interface_property x_motor_accelstep_pio_external_connection EXPORT_OF x_motor_accelstep_pio.external_connection
add_interface x_motor_ctrl_pio_external_connection conduit end
set_interface_property x_motor_ctrl_pio_external_connection EXPORT_OF x_motor_ctrl_pio.external_connection
add_interface x_motor_homeloc_pio_external_connection conduit end
set_interface_property x_motor_homeloc_pio_external_connection EXPORT_OF x_motor_homeloc_pio.external_connection
add_interface x_motor_homespeed_pio_external_connection conduit end
set_interface_property x_motor_homespeed_pio_external_connection EXPORT_OF x_motor_homespeed_pio.external_connection
add_interface x_motor_location_pio_external_connection conduit end
set_interface_property x_motor_location_pio_external_connection EXPORT_OF x_motor_location_pio.external_connection
add_interface x_motor_lowerlimit_pio_external_connection conduit end
set_interface_property x_motor_lowerlimit_pio_external_connection EXPORT_OF x_motor_lowerlimit_pio.external_connection
add_interface x_motor_max_speed_pio_external_connection conduit end
set_interface_property x_motor_max_speed_pio_external_connection EXPORT_OF x_motor_max_speed_pio.external_connection
add_interface x_motor_min_speed_pio_external_connection conduit end
set_interface_property x_motor_min_speed_pio_external_connection EXPORT_OF x_motor_min_speed_pio.external_connection
add_interface x_motor_status_pio_external_connection conduit end
set_interface_property x_motor_status_pio_external_connection EXPORT_OF x_motor_status_pio.external_connection
add_interface x_motor_stepincrement_pio_external_connection conduit end
set_interface_property x_motor_stepincrement_pio_external_connection EXPORT_OF x_motor_stepincrement_pio.external_connection
add_interface x_motor_target_pio_external_connection conduit end
set_interface_property x_motor_target_pio_external_connection EXPORT_OF x_motor_target_pio.external_connection
add_interface x_motor_upperlimit_pio_external_connection conduit end
set_interface_property x_motor_upperlimit_pio_external_connection EXPORT_OF x_motor_upperlimit_pio.external_connection
add_interface y_motor_accelstep_pio_external_connection conduit end
set_interface_property y_motor_accelstep_pio_external_connection EXPORT_OF y_motor_accelstep_pio.external_connection
add_interface y_motor_ctrl_pio_external_connection conduit end
set_interface_property y_motor_ctrl_pio_external_connection EXPORT_OF y_motor_ctrl_pio.external_connection
add_interface y_motor_homeloc_pio_external_connection conduit end
set_interface_property y_motor_homeloc_pio_external_connection EXPORT_OF y_motor_homeloc_pio.external_connection
add_interface y_motor_homespeed_pio_external_connection conduit end
set_interface_property y_motor_homespeed_pio_external_connection EXPORT_OF y_motor_homespeed_pio.external_connection
add_interface y_motor_location_pio_external_connection conduit end
set_interface_property y_motor_location_pio_external_connection EXPORT_OF y_motor_location_pio.external_connection
add_interface y_motor_lowerlimit_pio_external_connection conduit end
set_interface_property y_motor_lowerlimit_pio_external_connection EXPORT_OF y_motor_lowerlimit_pio.external_connection
add_interface y_motor_max_speed_pio_external_connection conduit end
set_interface_property y_motor_max_speed_pio_external_connection EXPORT_OF y_motor_max_speed_pio.external_connection
add_interface y_motor_min_speed_pio_external_connection conduit end
set_interface_property y_motor_min_speed_pio_external_connection EXPORT_OF y_motor_min_speed_pio.external_connection
add_interface y_motor_status_pio_external_connection conduit end
set_interface_property y_motor_status_pio_external_connection EXPORT_OF y_motor_status_pio.external_connection
add_interface y_motor_stepincrement_pio_external_connection conduit end
set_interface_property y_motor_stepincrement_pio_external_connection EXPORT_OF y_motor_stepincrement_pio.external_connection
add_interface y_motor_target_pio_external_connection conduit end
set_interface_property y_motor_target_pio_external_connection EXPORT_OF y_motor_target_pio.external_connection
add_interface y_motor_upperlimit_pio_external_connection conduit end
set_interface_property y_motor_upperlimit_pio_external_connection EXPORT_OF y_motor_upperlimit_pio.external_connection
add_interface z_motor_accelstep_pio_external_connection conduit end
set_interface_property z_motor_accelstep_pio_external_connection EXPORT_OF z_motor_accelstep_pio.external_connection
add_interface z_motor_ctrl_pio_external_connection conduit end
set_interface_property z_motor_ctrl_pio_external_connection EXPORT_OF z_motor_ctrl_pio.external_connection
add_interface z_motor_homeloc_pio_external_connection conduit end
set_interface_property z_motor_homeloc_pio_external_connection EXPORT_OF z_motor_homeloc_pio.external_connection
add_interface z_motor_homespeed_pio_external_connection conduit end
set_interface_property z_motor_homespeed_pio_external_connection EXPORT_OF z_motor_homespeed_pio.external_connection
add_interface z_motor_location_pio_external_connection conduit end
set_interface_property z_motor_location_pio_external_connection EXPORT_OF z_motor_location_pio.external_connection
add_interface z_motor_lowerlimit_pio_external_connection conduit end
set_interface_property z_motor_lowerlimit_pio_external_connection EXPORT_OF z_motor_lowerlimit_pio.external_connection
add_interface z_motor_max_speed_pio_external_connection conduit end
set_interface_property z_motor_max_speed_pio_external_connection EXPORT_OF z_motor_max_speed_pio.external_connection
add_interface z_motor_min_speed_pio_external_connection conduit end
set_interface_property z_motor_min_speed_pio_external_connection EXPORT_OF z_motor_min_speed_pio.external_connection
add_interface z_motor_status_pio_external_connection conduit end
set_interface_property z_motor_status_pio_external_connection EXPORT_OF z_motor_status_pio.external_connection
add_interface z_motor_stepincrement_pio_external_connection conduit end
set_interface_property z_motor_stepincrement_pio_external_connection EXPORT_OF z_motor_stepincrement_pio.external_connection
add_interface z_motor_target_pio_external_connection conduit end
set_interface_property z_motor_target_pio_external_connection EXPORT_OF z_motor_target_pio.external_connection
add_interface z_motor_upperlimit_pio_external_connection conduit end
set_interface_property z_motor_upperlimit_pio_external_connection EXPORT_OF z_motor_upperlimit_pio.external_connection

set_interconnect_requirement {$system} qsys_mm.clockCrossingAdapter HANDSHAKE
set_interconnect_requirement {$system} qsys_mm.maxAdditionalLatency 1

save_system soc_system.qsys
